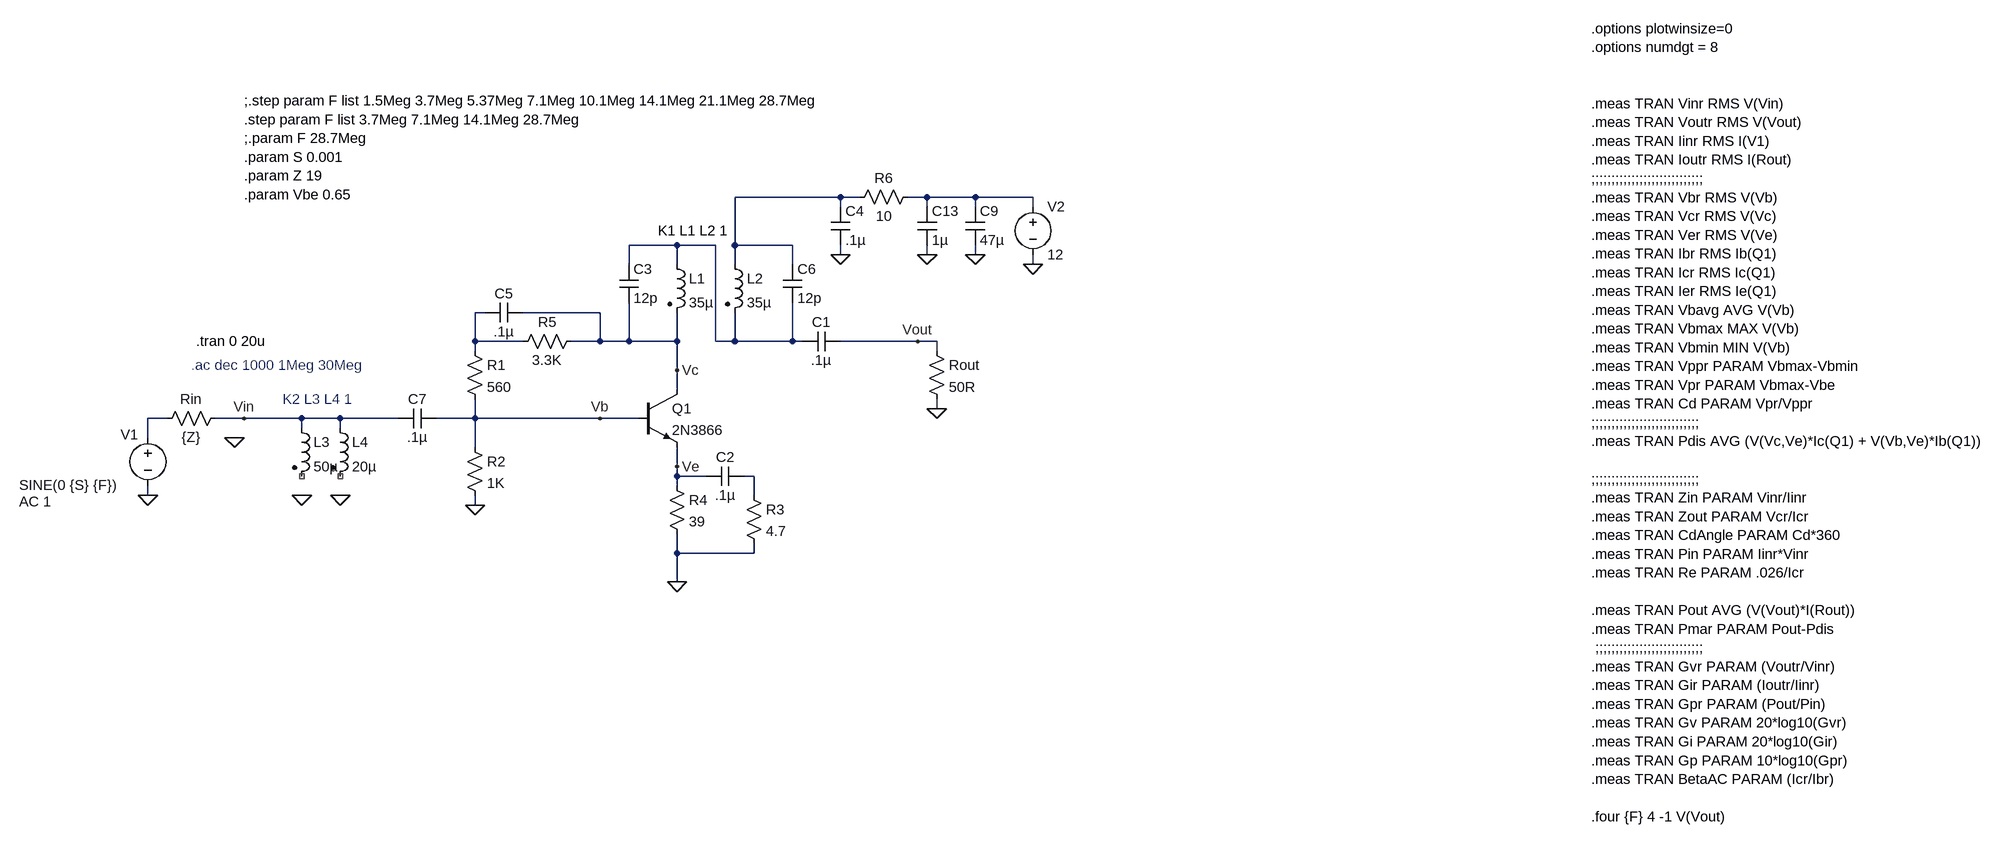
[diagram p0: schematic 2N3866 W1FB testing.asc]
2N3866 W1FB testing.asc, the LTspice schematic file:
Version 4
SHEET 1 2632 1496
WIRE 688 -176 512 -176
WIRE 720 -176 688 -176
WIRE 832 -176 800 -176
WIRE 912 -176 832 -176
WIRE 1008 -176 912 -176
WIRE 688 -160 688 -176
WIRE 832 -160 832 -176
WIRE 912 -160 912 -176
WIRE 1008 -160 1008 -176
WIRE 416 -96 336 -96
WIRE 480 -96 416 -96
WIRE 512 -96 512 -176
WIRE 608 -96 512 -96
WIRE 688 -80 688 -96
WIRE 832 -80 832 -96
WIRE 912 -80 912 -96
WIRE 336 -64 336 -96
WIRE 416 -64 416 -96
WIRE 512 -64 512 -96
WIRE 608 -64 608 -96
WIRE 1008 -64 1008 -80
WIRE 96 16 80 16
WIRE 288 16 160 16
WIRE 80 64 80 16
WIRE 160 64 80 64
WIRE 288 64 288 16
WIRE 288 64 240 64
WIRE 336 64 336 0
WIRE 336 64 288 64
WIRE 416 64 416 16
WIRE 416 64 336 64
WIRE 480 64 480 -96
WIRE 512 64 512 16
WIRE 512 64 480 64
WIRE 608 64 608 0
WIRE 608 64 512 64
WIRE 624 64 608 64
WIRE 816 64 688 64
WIRE 848 64 816 64
WIRE 80 80 80 64
WIRE 848 80 848 64
WIRE 416 112 416 64
WIRE 416 144 416 112
WIRE 848 176 848 160
WIRE -432 192 -464 192
WIRE -304 192 -352 192
WIRE -208 192 -304 192
WIRE -144 192 -208 192
WIRE -48 192 -144 192
WIRE 80 192 80 160
WIRE 80 192 16 192
WIRE 288 192 80 192
WIRE 352 192 288 192
WIRE -208 208 -208 192
WIRE -144 208 -144 192
WIRE -464 224 -464 192
WIRE 80 240 80 192
WIRE 416 272 416 240
WIRE 416 288 416 272
WIRE 464 288 416 288
WIRE 544 288 528 288
WIRE 416 304 416 288
WIRE -464 320 -464 304
WIRE 544 320 544 288
WIRE 80 336 80 320
WIRE 416 416 416 384
WIRE 544 416 544 400
WIRE 544 416 416 416
WIRE 416 464 416 416
FLAG -464 320 0
FLAG 80 336 0
FLAG 416 464 0
FLAG 816 64 Vout
FLAG 848 176 0
FLAG 288 192 Vb
FLAG 416 272 Ve
FLAG -304 192 Vin
FLAG 416 112 Vc
FLAG -320 224 0
FLAG 688 -80 0
FLAG 1008 -64 0
FLAG 912 -80 0
FLAG 832 -80 0
FLAG -144 320 0
FLAG -208 320 0
SYMBOL voltage -464 208 R0
WINDOW 0 -45 11 Left 2
WINDOW 3 -214 95 Left 2
WINDOW 123 -214 123 Left 2
WINDOW 39 -214 151 Left 2
SYMATTR InstName V1
SYMATTR Value SINE(0 {S} {F})
SYMATTR Value2 AC 1
SYMBOL res 64 64 R0
SYMATTR InstName R1
SYMATTR Value 560
SYMBOL res 64 224 R0
SYMATTR InstName R2
SYMATTR Value 1K
SYMBOL res 400 288 R0
SYMATTR InstName R4
SYMATTR Value 39
SYMBOL ind2 400 -80 R0
SYMATTR InstName L1
SYMATTR Value 35µ
SYMATTR Type ind
SYMBOL res 832 64 R0
SYMATTR InstName Rout
SYMATTR Value 50R
SYMBOL cap 16 176 R90
WINDOW 0 0 32 VBottom 2
WINDOW 3 32 32 VTop 2
SYMATTR InstName C7
SYMATTR Value .1µ
SYMBOL ind2 496 -80 R0
SYMATTR InstName L2
SYMATTR Value 35µ
SYMATTR Type ind
SYMBOL npn 352 144 R0
SYMATTR InstName Q1
SYMATTR Value 2N3866
SYMBOL cap 688 48 R90
WINDOW 0 0 32 VBottom 2
WINDOW 3 32 32 VTop 2
SYMATTR InstName C1
SYMATTR Value .1µ
SYMBOL cap 528 272 R90
WINDOW 0 0 32 VBottom 2
WINDOW 3 32 32 VTop 2
SYMATTR InstName C2
SYMATTR Value .1µ
SYMBOL res 528 304 R0
SYMATTR InstName R3
SYMATTR Value 4.7
SYMBOL cap 672 -160 R0
SYMATTR InstName C4
SYMATTR Value .1µ
SYMBOL res 256 48 R90
WINDOW 0 0 56 VBottom 2
WINDOW 3 32 56 VTop 2
SYMATTR InstName R5
SYMATTR Value 3.3K
SYMBOL cap 160 0 R90
WINDOW 0 0 32 VBottom 2
WINDOW 3 32 32 VTop 2
SYMATTR InstName C5
SYMATTR Value .1µ
SYMBOL cap 320 -64 R0
SYMATTR InstName C3
SYMATTR Value 12p
SYMBOL cap 592 -64 R0
SYMATTR InstName C6
SYMATTR Value 12p
SYMBOL voltage 1008 -176 R0
WINDOW 123 0 0 Left 0
WINDOW 39 0 0 Left 0
SYMATTR InstName V2
SYMATTR Value 12
SYMBOL cap 896 -160 R0
SYMATTR InstName C9
SYMATTR Value 47µ
SYMBOL cap 816 -160 R0
SYMATTR InstName C13
SYMATTR Value 1µ
SYMBOL res 816 -192 R90
WINDOW 0 0 56 VBottom 2
WINDOW 3 32 56 VTop 2
SYMATTR InstName R6
SYMATTR Value 10
SYMBOL ind2 -224 192 R0
SYMATTR InstName L3
SYMATTR Value 50µ
SYMATTR Type ind
SYMBOL ind2 -160 192 R0
SYMATTR InstName L4
SYMATTR Value 20µ
SYMATTR Type ind
SYMBOL res -336 176 R90
WINDOW 0 0 56 VBottom 2
WINDOW 3 32 56 VTop 2
SYMATTR InstName Rin
SYMATTR Value {Z}
TEXT -384 64 Left 2 !.tran 0 20u
TEXT 1936 -456 Left 2 !.options plotwinsize=0\n.options numdgt = 8\n \n \n.meas TRAN Vinr RMS V(Vin)\n.meas TRAN Voutr RMS V(Vout)\n.meas TRAN Iinr RMS I(V1)\n.meas TRAN Ioutr RMS I(Rout)\n;;;;;;;;;;;;;;;;;;;;;;;;;;;;\n.meas TRAN Vbr RMS V(Vb)\n.meas TRAN Vcr RMS V(Vc)\n.meas TRAN Ver RMS V(Ve)\n.meas TRAN Ibr RMS Ib(Q1)\n.meas TRAN Icr RMS Ic(Q1)\n.meas TRAN Ier RMS Ie(Q1)\n.meas TRAN Vbavg AVG V(Vb)\n.meas TRAN Vbmax MAX V(Vb)\n.meas TRAN Vbmin MIN V(Vb)\n.meas TRAN Vppr PARAM Vbmax-Vbmin\n.meas TRAN Vpr PARAM Vbmax-Vbe\n.meas TRAN Cd PARAM Vpr/Vppr\n;;;;;;;;;;;;;;;;;;;;;;;;;;;\n.meas TRAN Pdis AVG (V(Vc,Ve)*Ic(Q1) + V(Vb,Ve)*Ib(Q1))\n \n;;;;;;;;;;;;;;;;;;;;;;;;;;;\n.meas TRAN Zin PARAM Vinr/Iinr\n.meas TRAN Zout PARAM Vcr/Icr\n.meas TRAN CdAngle PARAM Cd*360\n.meas TRAN Pin PARAM Iinr*Vinr\n.meas TRAN Re PARAM .026/Icr\n \n.meas TRAN Pout AVG (V(Vout)*I(Rout))\n.meas TRAN Pmar PARAM Pout-Pdis\n ;;;;;;;;;;;;;;;;;;;;;;;;;;;\n.meas TRAN Gvr PARAM (Voutr/Vinr)\n.meas TRAN Gir PARAM (Ioutr/Iinr)\n.meas TRAN Gpr PARAM (Pout/Pin)\n.meas TRAN Gv PARAM 20*log10(Gvr)\n.meas TRAN Gi PARAM 20*log10(Gir)\n.meas TRAN Gp PARAM 10*log10(Gpr)\n.meas TRAN BetaAC PARAM (Icr/Ibr)\n \n.four {F} 4 -1 V(Vout)
TEXT -304 -336 Left 2 !;.step param F list 1.5Meg 3.7Meg 5.37Meg 7.1Meg 10.1Meg 14.1Meg 21.1Meg 28.7Meg\n.step param F list 3.7Meg 7.1Meg 14.1Meg 28.7Meg\n;.param F 28.7Meg\n.param S 0.001\n.param Z 19\n.param Vbe 0.65
TEXT -392 104 Left 2 ;.ac dec 1000 1Meg 30Meg
TEXT 384 -120 Left 2 !K1 L1 L2 1
TEXT -240 160 Left 2 ;K2 L3 L4 1

The netlist it stands for:
* 2N3866 W1FB testing.asc
V1 N005 0 SINE(0 {S} {F}) AC 1
R1 N004 Vb 560
R2 Vb 0 1K
R4 Ve 0 39
L1 N003 Vc 35µ
Rout Vout 0 50R
C7 Vb Vin .1µ
L2 N001 N003 35µ
Q1 Vc Vb Ve 0 2N3866
C1 Vout N003 .1µ
C2 N006 Ve .1µ
R3 N006 0 4.7
C4 N001 0 .1µ
R5 Vc N004 3.3K
C5 Vc N004 .1µ
C3 N003 Vc 12p
C6 N001 N003 12p
V2 N002 0 12
C9 N002 0 47µ
C13 N002 0 1µ
R6 N002 N001 10
L3 Vin NC_01 50µ
L4 Vin NC_02 20µ
Rin Vin N005 {Z}
.model NPN NPN
.model PNP PNP
.lib standard.bjt
.tran 0 20u
.options plotwinsize=0
.options numdgt = 8
.meas TRAN Vinr RMS V(Vin)
.meas TRAN Voutr RMS V(Vout)
.meas TRAN Iinr RMS I(V1)
.meas TRAN Ioutr RMS I(Rout)
;;;;;;;;;;;;;;;;;;;;;;;;;;;;
.meas TRAN Vbr RMS V(Vb)
.meas TRAN Vcr RMS V(Vc)
.meas TRAN Ver RMS V(Ve)
.meas TRAN Ibr RMS Ib(Q1)
.meas TRAN Icr RMS Ic(Q1)
.meas TRAN Ier RMS Ie(Q1)
.meas TRAN Vbavg AVG V(Vb)
.meas TRAN Vbmax MAX V(Vb)
.meas TRAN Vbmin MIN V(Vb)
.meas TRAN Vppr PARAM Vbmax-Vbmin
.meas TRAN Vpr PARAM Vbmax-Vbe
.meas TRAN Cd PARAM Vpr/Vppr
;;;;;;;;;;;;;;;;;;;;;;;;;;;
.meas TRAN Pdis AVG (V(Vc,Ve)*Ic(Q1) + V(Vb,Ve)*Ib(Q1))
;;;;;;;;;;;;;;;;;;;;;;;;;;;
.meas TRAN Zin PARAM Vinr/Iinr
.meas TRAN Zout PARAM Vcr/Icr
.meas TRAN CdAngle PARAM Cd*360
.meas TRAN Pin PARAM Iinr*Vinr
.meas TRAN Re PARAM .026/Icr
.meas TRAN Pout AVG (V(Vout)*I(Rout))
.meas TRAN Pmar PARAM Pout-Pdis
 ;;;;;;;;;;;;;;;;;;;;;;;;;;;
.meas TRAN Gvr PARAM (Voutr/Vinr)
.meas TRAN Gir PARAM (Ioutr/Iinr)
.meas TRAN Gpr PARAM (Pout/Pin)
.meas TRAN Gv PARAM 20*log10(Gvr)
.meas TRAN Gi PARAM 20*log10(Gir)
.meas TRAN Gp PARAM 10*log10(Gpr)
.meas TRAN BetaAC PARAM (Icr/Ibr)
.four {F} 4 -1 V(Vout)
;.step param F list 1.5Meg 3.7Meg 5.37Meg 7.1Meg 10.1Meg 14.1Meg 21.1Meg 28.7Meg
.step param F list 3.7Meg 7.1Meg 14.1Meg 28.7Meg
;.param F 28.7Meg
.param S 0.001
.param Z 19
.param Vbe 0.65
* .ac dec 1000 1Meg 30Meg
K1 L1 L2 1
* K2 L3 L4 1
.backanno
.end